# Altium schematic sheet Ethernet.SchDoc: Ixora
size A3; Organization: Toradex AG; Address1: Altsagenstrasse 5; Address2: Horw; Address3: 6048; Address4: Switzerland; DocumentNumber: 9; Revision: V1.1; SheetNumber: 10; SheetTotal: 17; PageSetup: Record=PageOptions|CenterHorizontal=True|CenterVertical=True|PrintScale=0.73|XCorrection=1.00|YCorrection=1.00|PrintKind=0|BorderSize=5000000|LeftOffset=0|BottomOffset=0|Orientation=2|PaperLength=1000|PaperWidth=1000|Scale=100|PaperSource=7|PrintQuality=-4|MediaType=1|DitherType=10|PaperKind=A4|PrintScaleMode=1
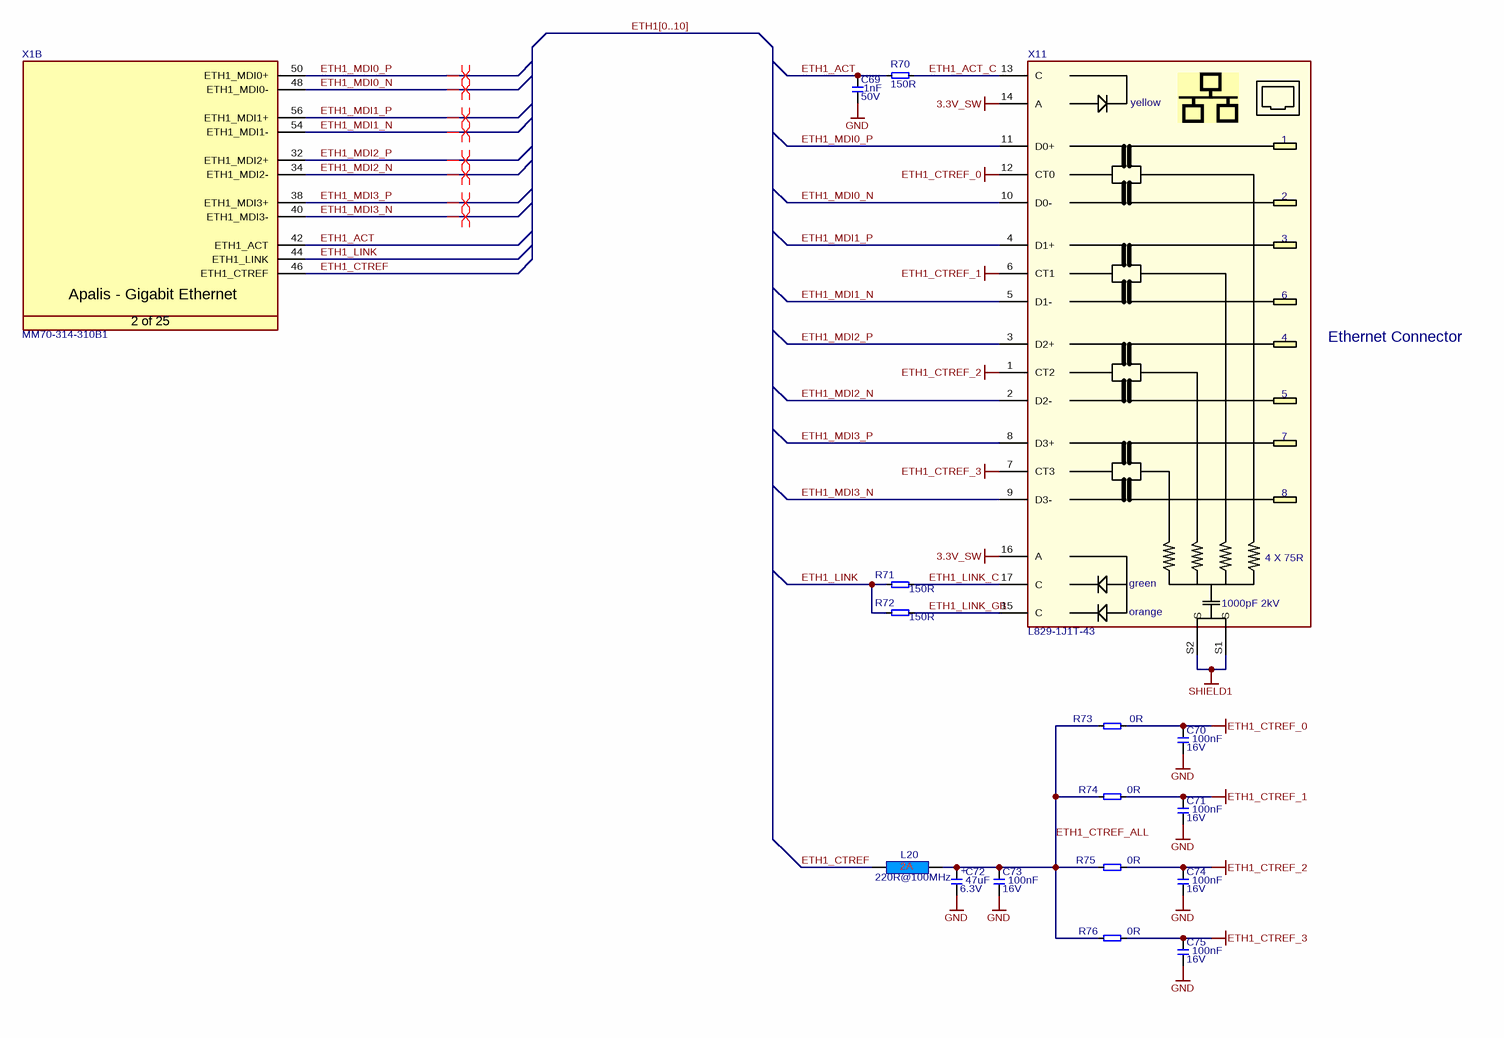
[diagram p0: Ethernet.SchDoc]

## Parts
C69  Rating: 50V  [CAPC1005X60N]  (hidden comment: 1nF)
C70  Rating: 16V  [CAPC1005X60N]  (hidden comment: 100nF)
C71  Rating: 16V  [CAPC1005X60N]  (hidden comment: 100nF)
C72  Rating: 6.3V  [T_CAPMP3216X180N]  (hidden comment: 47uF)
C73  Rating: 16V  [CAPC1005X60N]  (hidden comment: 100nF)
C74  Rating: 16V  [CAPC1005X60N]  (hidden comment: 100nF)
C75  Rating: 16V  [CAPC1005X60N]  (hidden comment: 100nF)
L20  220R@100MHz  [INDC1608X95N]
R70  150R  [RESC1005X40N]
R71  150R  [RESC1005X40N]
R72  150R  [RESC1005X40N]
R73  0R  [RESC1005X40N]
R74  0R  [RESC1005X40N]
R75  0R  [RESC1005X40N]
R76  0R  [RESC1005X40N]
X1  Manufacturer Part No.: MM70-314-310B1  [T_JAE_MM70-314-310B1]  (hidden comment: CON-JAE-MM70-314-310B1-314-0.5mm)  (part B of 25)
X11  L829-1J1T-43  [T_BEL_L829-1J1T-43]

## Nets
3.3V_SW: X11.14(A) X11.16(A)
ETH1_CTREF_0: C70.2 R73.2 X11.12(CT0)
ETH1_CTREF_1: C71.2 R74.2 X11.6(CT1)
ETH1_CTREF_2: C74.2 R75.2 X11.1(CT2)
ETH1_CTREF_3: C75.2 R76.2 X11.7(CT3)
GND: C69.1 C70.1 C71.1 C72.2 C73.1 C74.1 C75.1
SHIELD1: X11.S1(S) X11.S2(S)
ETH1_ACT: C69.2 R70.1 X1.42(ETH1_ACT)
ETH1_ACT_C: R70.2 X11.13(C)
ETH1_CTREF: L20.1 X1.46(ETH1_CTREF)
ETH1_CTREF_ALL: C72.1 C73.2 L20.2 R73.1 R74.1 R75.1 R76.1
ETH1_LINK: R71.1 R72.1 X1.44(ETH1_LINK)
ETH1_LINK_C: R71.2 X11.17(C)
ETH1_LINK_GB: R72.2 X11.15(C)
ETH1_MDI0_N: X1.48(ETH1_MDI0-) X11.10(D0-)
ETH1_MDI0_P: X1.50(ETH1_MDI0+) X11.11(D0+)
ETH1_MDI1_N: X1.54(ETH1_MDI1-) X11.5(D1-)
ETH1_MDI1_P: X1.56(ETH1_MDI1+) X11.4(D1+)
ETH1_MDI2_N: X1.34(ETH1_MDI2-) X11.2(D2-)
ETH1_MDI2_P: X1.32(ETH1_MDI2+) X11.3(D2+)
ETH1_MDI3_N: X1.40(ETH1_MDI3-) X11.9(D3-)
ETH1_MDI3_P: X1.38(ETH1_MDI3+) X11.8(D3+)

## Buses and harness runs
bus ETH1[0..10]

## Layout directives
differential pair: ETH1_MDI0_N, ETH1_MDI0_P, ETH1_MDI1_N, ETH1_MDI1_P, ETH1_MDI2_N, ETH1_MDI2_P, ETH1_MDI3_N, ETH1_MDI3_P

## Notes on the sheet
- Ethernet Connector
- Title
- Size:
- Date:
- A3
- Number:
- Time:
- Revision:
- Sheet
- of
- File:
- (in symbol C-TA-47uF-6.3V-20%-3216) +
- (in symbol CON-BEL-L829-1J1T-43) yellow; 4 X 75R; green; 1000pF 2kV; orange
- (in symbol CON-JAE-MM70-314-310B1-314-0.5mm, part B) Apalis - Gigabit Ethernet; 2 of 25

## Library data of the parts
C69 = C-X7R-1nF-50V-10%-0402: Capacitor Ceramic X7R 1nF 50V 10% 0402; Tolerance: 10%; Type: X7R; Value: 1nF
C70 C71 C73-C75 = C-X7R-100nF-16V-10%-0402: Capacitor Ceramic X7R 100nF 16V 10% 0402; Tolerance: 10%; Type: X7R; Value: 100nF
C72 = C-TA-47uF-6.3V-20%-3216: Capacitor TA 47uF 6.3V 20% 3216; Tolerance: 20%; Type: TA; Value: 47uF
L20 = L-220R@100MHz-2A-25%-0603: 220R@100MHz 2A EMI FILTER; Tolerance: 25%; Rating: 2A; Value: 220R@100MHz
R70-R72 = R-150R-63mW-1%-0402: Resistor 150 ohm 63mW 1% 0402; Tolerance: 1%; Value: 150R; Rating: 63mW
R73-R76 = R-0R-63mW-1%-0402: Resistor 0 ohm 63mW 1% 0402; Rating: 63mW; Tolerance: 1%; Value: 0R
X1 = CON-JAE-MM70-314-310B1-314-0.5mm: MXM3 Connector; Manufacturer Name: JAE; No. of ways: 314
X11 = CON-BEL-L829-1J1T-43: Low profile 10/100/1G Mag Jack; Manufacturer Name: BEL; Manufacturer Part No.: L829-1J1T-43